# Altium project Sensl_Array_Readout.PrjPCB
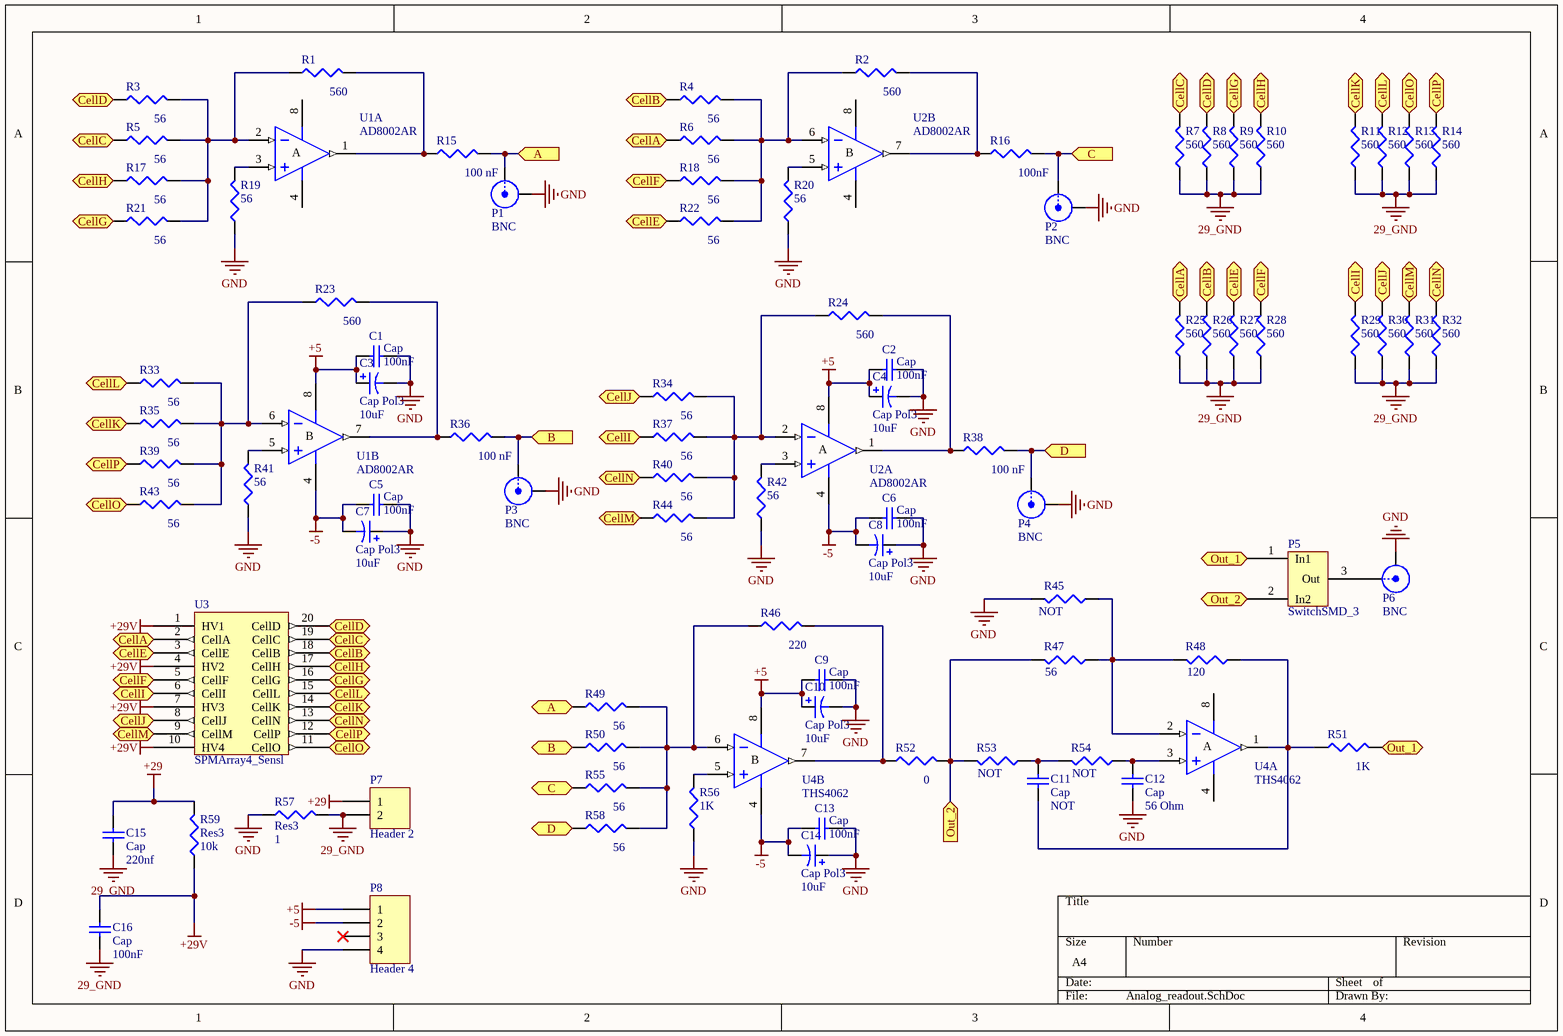
[diagram p0: Analog_readout.SchDoc]
1 sheet, 87 parts. Net scope: flat (ports and power ports of the same name join across sheets).
Board file: Analog_readout_v2.PcbDoc

## Sheet Analog_readout.SchDoc
size A4

### Parts
C1  Cap  value 100nF  [6-0805_N]
C2  Cap  value 100nF  [6-0805_N]
C3  Cap Pol3  value 10uF  [6-0805_N]
C4  Cap Pol3  value 10uF  [6-0805_N]
C5  Cap  value 100nF  [6-0805_N]
C6  Cap  value 100nF  [6-0805_N]
C7  Cap Pol3  value 10uF  [6-0805_N]
C8  Cap Pol3  value 10uF  [6-0805_N]
C9  Cap  value 100nF  [6-0805_N]
C10  Cap Pol3  value 10uF  [6-0805_N]
C11  Cap  value NOT  [6-0805_N]
C12  Cap  value 56 Ohm  [6-0805_N]
C13  Cap  value 100nF  [6-0805_N]
C14  Cap Pol3  value 10uF  [6-0805_N]
C15  Cap  value 220nf  [6-0805_N]
C16  Cap  value 100nF  [6-0805_N]
P1  BNC  [BNC_RA CON]
P2  BNC  [BNC_RA CON]
P3  BNC  [BNC_RA CON]
P4  BNC  [BNC_RA CON]
P5  SwitchSMD_3  [SwitchSMD_0603]
P6  BNC  [BNC_RA CON]
P7  Header 2  [HDR1X2]
P8  Header 4  [HDR1X4]
R1  value 560  [6-0805_N]  (hidden comment: Res3)
R2  value 560  [6-0805_N]  (hidden comment: Res3)
R3  value 56  [6-0805_N]  (hidden comment: Res3)
R4  value 56  [6-0805_N]  (hidden comment: Res3)
R5  value 56  [6-0805_N]  (hidden comment: Res3)
R6  value 56  [6-0805_N]  (hidden comment: Res3)
R7  value 560  [J1-0603]  (hidden comment: Res3)
R8  value 560  [J1-0603]  (hidden comment: Res3)
R9  value 560  [J1-0603]  (hidden comment: Res3)
R10  value 560  [J1-0603]  (hidden comment: Res3)
R11  value 560  [J1-0603]  (hidden comment: Res3)
R12  value 560  [J1-0603]  (hidden comment: Res3)
R13  value 560  [J1-0603]  (hidden comment: Res3)
R14  value 560  [J1-0603]  (hidden comment: Res3)
R15  value 100 nF  [6-0805_N]  (hidden comment: Res3)
R16  value 100nF  [6-0805_N]  (hidden comment: Res3)
R17  value 56  [6-0805_N]  (hidden comment: Res3)
R18  value 56  [6-0805_N]  (hidden comment: Res3)
R19  value 56  [6-0805_N]  (hidden comment: Res3)
R20  value 56  [6-0805_N]  (hidden comment: Res3)
R21  value 56  [6-0805_N]  (hidden comment: Res3)
R22  value 56  [6-0805_N]  (hidden comment: Res3)
R23  value 560  [6-0805_N]  (hidden comment: Res3)
R24  value 560  [6-0805_N]  (hidden comment: Res3)
R25  value 560  [J1-0603]  (hidden comment: Res3)
R26  value 560  [J1-0603]  (hidden comment: Res3)
R27  value 560  [J1-0603]  (hidden comment: Res3)
R28  value 560  [J1-0603]  (hidden comment: Res3)
R29  value 560  [J1-0603]  (hidden comment: Res3)
R30  value 560  [J1-0603]  (hidden comment: Res3)
R31  value 560  [J1-0603]  (hidden comment: Res3)
R32  value 560  [J1-0603]  (hidden comment: Res3)
R33  value 56  [6-0805_N]  (hidden comment: Res3)
R34  value 56  [6-0805_N]  (hidden comment: Res3)
R35  value 56  [6-0805_N]  (hidden comment: Res3)
R36  value 100 nF  [6-0805_N]  (hidden comment: Res3)
R37  value 56  [6-0805_N]  (hidden comment: Res3)
R38  value 100 nF  [6-0805_N]  (hidden comment: Res3)
R39  value 56  [6-0805_N]  (hidden comment: Res3)
R40  value 56  [6-0805_N]  (hidden comment: Res3)
R41  value 56  [6-0805_N]  (hidden comment: Res3)
R42  value 56  [6-0805_N]  (hidden comment: Res3)
R43  value 56  [6-0805_N]  (hidden comment: Res3)
R44  value 56  [6-0805_N]  (hidden comment: Res3)
R45  value NOT  [6-0805_N]  (hidden comment: Res3)
R46  value 220  [6-0805_N]  (hidden comment: Res3)
R47  value 56  [6-0805_N]  (hidden comment: Res3)
R48  value 120  [6-0805_N]  (hidden comment: Res3)
R49  value 56  [6-0805_N]  (hidden comment: Res3)
R50  value 56  [6-0805_N]  (hidden comment: Res3)
R51  value 1K  [6-0805_N]  (hidden comment: Res3)
R52  value 0  [6-0805_N]  (hidden comment: Res3)
R53  value NOT  [6-0805_N]  (hidden comment: Res3)
R54  value NOT  [6-0805_N]  (hidden comment: Res3)
R55  value 56  [6-0805_N]  (hidden comment: Res3)
R56  value 1K  [6-0805_N]  (hidden comment: Res3)
R57  Res3  value 1  [6-0805_N]
R58  value 56  [6-0805_N]  (hidden comment: Res3)
R59  Res3  value 10k  [6-0805_N]
U1  AD8002AR  [SO-8_M]  (parts A,B of 2)
U2  AD8002AR  [SO-8_M]  (parts A,B of 2)
U3  SPMArray4_Sensl  [Sensl_PGA20P_v2]
U4  THS4062  [SO-8_M]  (parts A,B of 2)

### Ports
A (in), A (out), B (in), B (out), C (in), C (out), CellA (out), CellB (out), CellC (out), CellD (out), CellE (out), CellF (out), CellG (out), CellH (out), CellI (out), CellJ (out), CellK (out), CellL (out), CellM (out), CellN (out), CellO (out), CellP (out), D (in), D (out), Out_1 (in), Out_1 (out), Out_2 (in), Out_2 (out)

### Nets
29_GND: C15.1 C16.1 P7.2 R7.1 R8.1 R9.1 R10.1 R11.1 R12.1 R13.1 R14.1 R25.1 R26.1 R27.1 R28.1 R29.1 R30.1 R31.1 R32.1 R57.2
+5: C1.2 C2.2 C3.1 C4.1 C9.2 C10.1 P8.1 U1.8(V+) U2.8(V+) U4.8(V+)
+29: C15.2 P7.1 R59.2
+29V: C16.2 R59.1 U3.1(HV1) U3.4(HV2) U3.7(HV3) U3.10(HV4)
-5: C5.2 C6.2 C7.2 C8.2 C13.2 C14.2 P8.2 U1.4(V-) U2.4(V-) U4.4(V-)
GND: C1.1 C2.1 C3.2 C4.2 C5.1 C6.1 C7.1 C8.1 C9.1 C10.2 C12.2 C13.1 C14.1 P1.2(Y) P2.2(Y) P3.2(Y) P4.2(Y) P6.2(Y) P8.4 R19.1 R20.1 R41.1 R42.1 R45.2 R56.1 R57.1
NetC11_1: C11.1 R53.1 R54.2
NetC11_2: C11.2 R48.1 R51.1 U4.1(OUT)
NetC12_1: C12.1 R54.1 U4.3(IN+)
NetP1_1: P1.1(X) R15.2 R49.1 ; port A
NetP2_1: P2.1(X) R16.2 R55.1 ; port C
NetP3_1: P3.1(X) R36.2 R50.1 ; port B
NetP4_1: P4.1(X) R38.2 R58.1 ; port D
NetP5_1: P5.1(In1) R51.2 ; port Out_1
NetP5_2: P5.2(In2) R47.2 R52.2 R53.2 ; port Out_2
NetP5_3: P5.3(Out) P6.1(X)
NetR1_1: R1.1 R3.2 R5.2 R17.2 R21.2 U1.2(IN-)
NetR1_2: R1.2 R15.1 U1.1(OUT)
NetR2_1: R2.1 R4.2 R6.2 R18.2 R22.2 U2.6(IN-)
NetR2_2: R2.2 R16.1 U2.7(OUT)
NetR3_1: R3.1 R8.2 U3.20(CellD) ; port CellD
NetR4_1: R4.1 R26.2 U3.18(CellB) ; port CellB
NetR5_1: R5.1 R7.2 U3.19(CellC) ; port CellC
NetR6_1: R6.1 R25.2 U3.2(CellA) ; port CellA
NetR9_2: R9.2 R21.1 U3.16(CellG) ; port CellG
NetR10_2: R10.2 R17.1 U3.17(CellH) ; port CellH
NetR11_2: R11.2 R35.1 U3.14(CellK) ; port CellK
NetR12_2: R12.2 R33.1 U3.15(CellL) ; port CellL
NetR13_2: R13.2 R43.1 U3.11(CellO) ; port CellO
NetR14_2: R14.2 R39.1 U3.12(CellP) ; port CellP
NetR18_1: R18.1 R28.2 U3.5(CellF) ; port CellF
NetR19_2: R19.2 U1.3(IN+)
NetR20_2: R20.2 U2.5(IN+)
NetR22_1: R22.1 R27.2 U3.3(CellE) ; port CellE
NetR23_1: R23.1 R33.2 R35.2 R39.2 R43.2 U1.6(IN-)
NetR23_2: R23.2 R36.1 U1.7(OUT)
NetR24_1: R24.1 R34.2 R37.2 R40.2 R44.2 U2.2(IN-)
NetR24_2: R24.2 R38.1 U2.1(OUT)
NetR29_2: R29.2 R37.1 U3.6(CellI) ; port CellI
NetR30_2: R30.2 R34.1 U3.8(CellJ) ; port CellJ
NetR31_2: R31.2 R44.1 U3.9(CellM) ; port CellM
NetR32_2: R32.2 R40.1 U3.13(CellN) ; port CellN
NetR41_2: R41.2 U1.5(IN+)
NetR42_2: R42.2 U2.3(IN+)
NetR45_1: R45.1 R47.1 R48.2 U4.2(IN-)
NetR46_1: R46.1 R49.2 R50.2 R55.2 R58.2 U4.6(IN-)
NetR46_2: R46.2 R52.1 U4.7(OUT)
NetR56_2: R56.2 U4.5(IN+)

Not connected (* = marked no-connect by the designer): P8 3*

### Notes on the sheet
- (in symbol AD8002AR, part A) A
- (in symbol AD8002AR, part B) B

### Library data of the parts
C1 C2 C5 C6 C9 C11-C13 C15 C16 = Cap: Capacitor; Published: 8-Jun-2000; LatestRevisionDate: 17-Jul-2002; LatestRevisionNote: Re-released for DXP Platform.; PackageReference: RAD-0.3; Publisher: Altium Limited; PackageDescription: Radial Cap, Thru-Hole; 2 Leads; 0.3 in Pin Spacing
C3 C4 C7 C8 C10 C14 = Cap Pol3: Polarized Capacitor (Surface Mount); Published: 8-Jun-2000; LatestRevisionDate: 29-May-2009; LatestRevisionNote: IPC-7351 Footprint Added.; PackageReference: C0805; Publisher: Altium Limited; PackageDescription: Chip Capacitor
P1-P4 P6 = BNC: BNC Elbow Connector; LatestRevisionDate: 17-Jul-2002; LatestRevisionNote: Re-released for DXP Platform.; Publisher: Altium Limited
P7 = Header 2: Header, 2-Pin; LatestRevisionDate: 17-Jul-2002; LatestRevisionNote: Re-released for DXP Platform.; Publisher: Altium Limited
P8 = Header 4: Header, 4-Pin; LatestRevisionDate: 17-Jul-2002; LatestRevisionNote: Re-released for DXP Platform.; Publisher: Altium Limited
R1-R59 = Res3: Resistor; Published: 8-Jun-2000; LatestRevisionDate: 29-May-2009; LatestRevisionNote: IPC-7351 Footprint Added.; PackageReference: J1-0603; Publisher: Altium Limited; PackageDescription: Chip Resistor
U1 U2 U4 = AD8002AR: Dual 600MHz, 50mW Current Feedback Amplifier; Published: 8-Jun-2000; LatestRevisionDate: 13-Apr-2006; LatestRevisionNote: IPC-7351 Footprint Added.; DatasheetVersion: REV. C 1999; PackageVersion: revA; PackageReference: SO-8; Publisher: Altium Limited; PackageDescription: 8-Pin Small Outline Integrated Circuit 1.27 mm Pitch; Code_JEDEC: MS-012-AA; Code_IPC: SOIC127P600-8; ComponentLink1Description: Manufacturer Link; ComponentLink1URL: http://www.analog.com/en/prod/0,,759_786_AD8002%2C00.html; ComponentLink2Description: Datasheet; ComponentLink2URL: http://www.analog.com/UploadedFiles/Data_Sheets/147523773AD8002_d.pdf